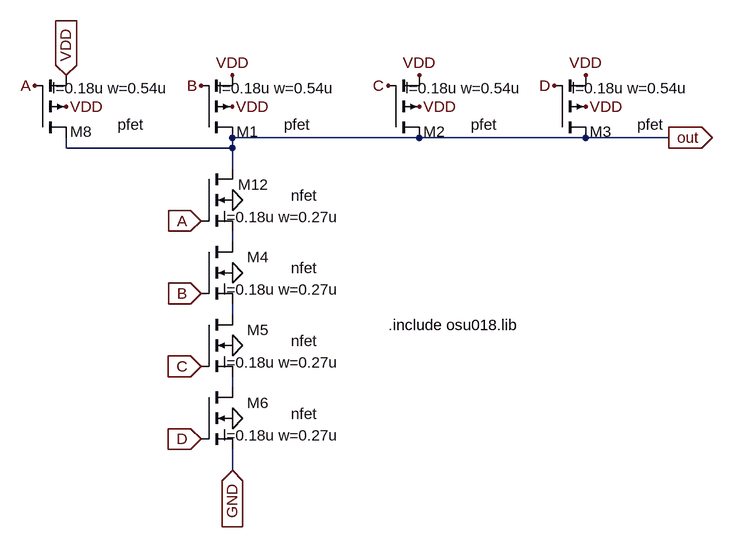
[diagram p0: schematic NAND_4.asc]
NAND_4.asc, the LTspice schematic file:
Version 4
SHEET 1 6288 680
WIRE 1456 -416 1168 -416
WIRE 1712 -416 1456 -416
WIRE 1840 -416 1712 -416
WIRE 912 -400 912 -416
WIRE 1168 -400 1168 -416
WIRE 1168 -400 912 -400
WIRE 1168 -368 1168 -400
WIRE 1168 -256 1168 -272
WIRE 1168 -144 1168 -160
WIRE 1168 -32 1168 -48
WIRE 1168 96 1168 64
FLAG 1168 -464 VDD
FLAG 1456 -464 VDD
FLAG 912 -464 VDD
FLAG 1712 -464 VDD
FLAG 1168 -96 0
FLAG 1168 -208 0
FLAG 1168 -320 0
FLAG 1168 16 0
FLAG 1168 -512 VDD
FLAG 1456 -512 VDD
FLAG 1712 -512 VDD
FLAG 912 -512 VDD
IOPIN 912 -512 In
FLAG 1168 96 GND
IOPIN 1168 96 In
FLAG 1840 -416 out
IOPIN 1840 -416 Out
FLAG 864 -496 A
FLAG 1120 -288 A
IOPIN 1120 -288 In
FLAG 1120 -496 B
FLAG 1120 -176 B
IOPIN 1120 -176 In
FLAG 1408 -496 C
FLAG 1120 -64 C
IOPIN 1120 -64 In
FLAG 1664 -496 D
FLAG 1120 48 D
IOPIN 1120 48 In
SYMBOL pmos4 864 -416 M180
WINDOW 0 88 9 Right 2
WINDOW 3 168 20 Right 2
WINDOW 123 206 76 Right 2
SYMATTR InstName M8
SYMATTR Value pfet
SYMATTR Value2 l=0.18u w=0.54u
SYMBOL nmos4 1120 -368 R0
WINDOW 0 104 24 Right 2
WINDOW 3 179 41 Right 2
WINDOW 123 213 74 Right 2
SYMATTR InstName M12
SYMATTR Value nfet
SYMATTR Value2 l=0.18u w=0.27u
SYMBOL pmos4 1120 -416 M180
WINDOW 0 88 9 Right 2
WINDOW 3 168 20 Right 2
WINDOW 123 206 76 Right 2
SYMATTR InstName M1
SYMATTR Value pfet
SYMATTR Value2 l=0.18u w=0.54u
SYMBOL pmos4 1408 -416 M180
WINDOW 0 88 9 Right 2
WINDOW 3 168 20 Right 2
WINDOW 123 206 76 Right 2
SYMATTR InstName M2
SYMATTR Value pfet
SYMATTR Value2 l=0.18u w=0.54u
SYMBOL pmos4 1664 -416 M180
WINDOW 0 88 9 Right 2
WINDOW 3 168 20 Right 2
WINDOW 123 206 76 Right 2
SYMATTR InstName M3
SYMATTR Value pfet
SYMATTR Value2 l=0.18u w=0.54u
SYMBOL nmos4 1120 -256 R0
WINDOW 0 104 24 Right 2
WINDOW 3 179 41 Right 2
WINDOW 123 213 74 Right 2
SYMATTR InstName M4
SYMATTR Value nfet
SYMATTR Value2 l=0.18u w=0.27u
SYMBOL nmos4 1120 -144 R0
WINDOW 0 104 24 Right 2
WINDOW 3 179 41 Right 2
WINDOW 123 213 74 Right 2
SYMATTR InstName M5
SYMATTR Value nfet
SYMATTR Value2 l=0.18u w=0.27u
SYMBOL nmos4 1120 -32 R0
WINDOW 0 104 24 Right 2
WINDOW 3 179 41 Right 2
WINDOW 123 213 74 Right 2
SYMATTR InstName M6
SYMATTR Value nfet
SYMATTR Value2 l=0.18u w=0.27u
TEXT 1408 -128 Left 2 !.include osu018.lib

The netlist it stands for:
* NAND_4.asc
M8 out A VDD VDD pfet l=0.18u w=0.54u
M12 out A N001 0 nfet l=0.18u w=0.27u
M1 out B VDD VDD pfet l=0.18u w=0.54u
M2 out C VDD VDD pfet l=0.18u w=0.54u
M3 out D VDD VDD pfet l=0.18u w=0.54u
M4 N001 B N002 0 nfet l=0.18u w=0.27u
M5 N002 C N003 0 nfet l=0.18u w=0.27u
M6 N003 D GND 0 nfet l=0.18u w=0.27u
.model NMOS NMOS
.model PMOS PMOS
.lib standard.mos
.include osu018.lib
.backanno
.end